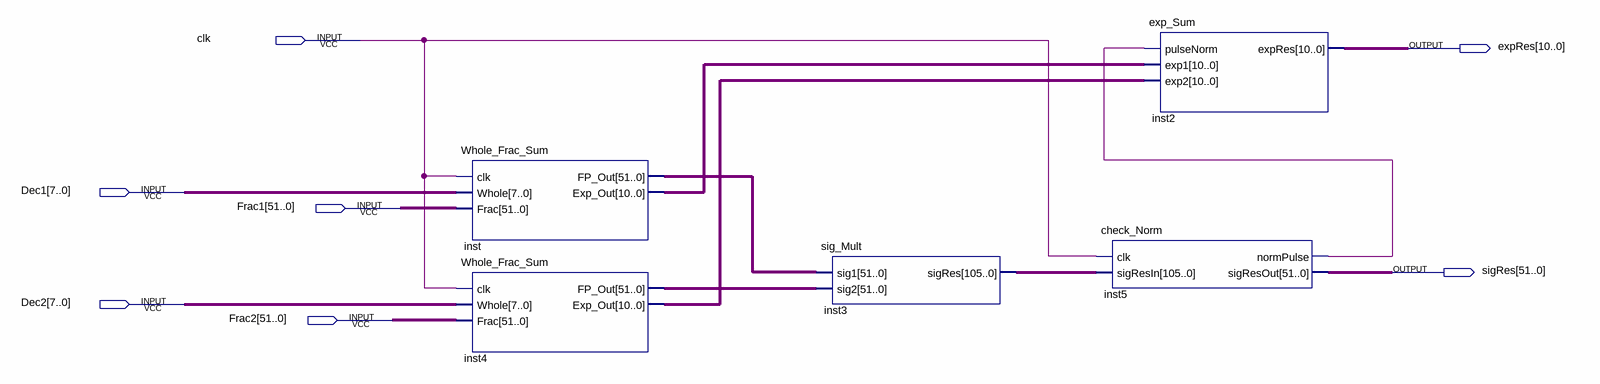
[diagram p0: schematic sheet]
// Quartus schematic System.bdf as structural Verilog: 5 symbols, 7 pins
module System (
  input  clk,
  input  [7:0] Dec1,
  input  [51:0] Frac1,
  input  [7:0] Dec2,
  input  [51:0] Frac2,
  output [10:0] expRes,
  output [51:0] sigRes
);

  wire inst5_normpulse;
  wire [10:0] inst4_exp_out, inst_exp_out;
  wire [51:0] inst4_fp_out, inst_fp_out;
  wire [105:0] inst3_sigres;

  Whole_Frac_Sum inst (.clk(clk), .Whole(Dec1), .Frac(Frac1), .FP_Out(inst_fp_out), .Exp_Out(inst_exp_out));
  Whole_Frac_Sum inst4 (.clk(clk), .Whole(Dec2), .Frac(Frac2), .FP_Out(inst4_fp_out), .Exp_Out(inst4_exp_out));
  sig_Mult inst3 (.sig1(inst_fp_out), .sig2(inst4_fp_out), .sigRes(inst3_sigres));
  check_Norm inst5 (.clk(clk), .sigResIn(inst3_sigres), .normPulse(inst5_normpulse), .sigResOut(sigRes));
  exp_Sum inst2 (.pulseNorm(inst5_normpulse), .exp1(inst_exp_out), .exp2(inst4_exp_out), .expRes(expRes));
endmodule
